# Altium project GNSS_FE_PROD.PrjPcb
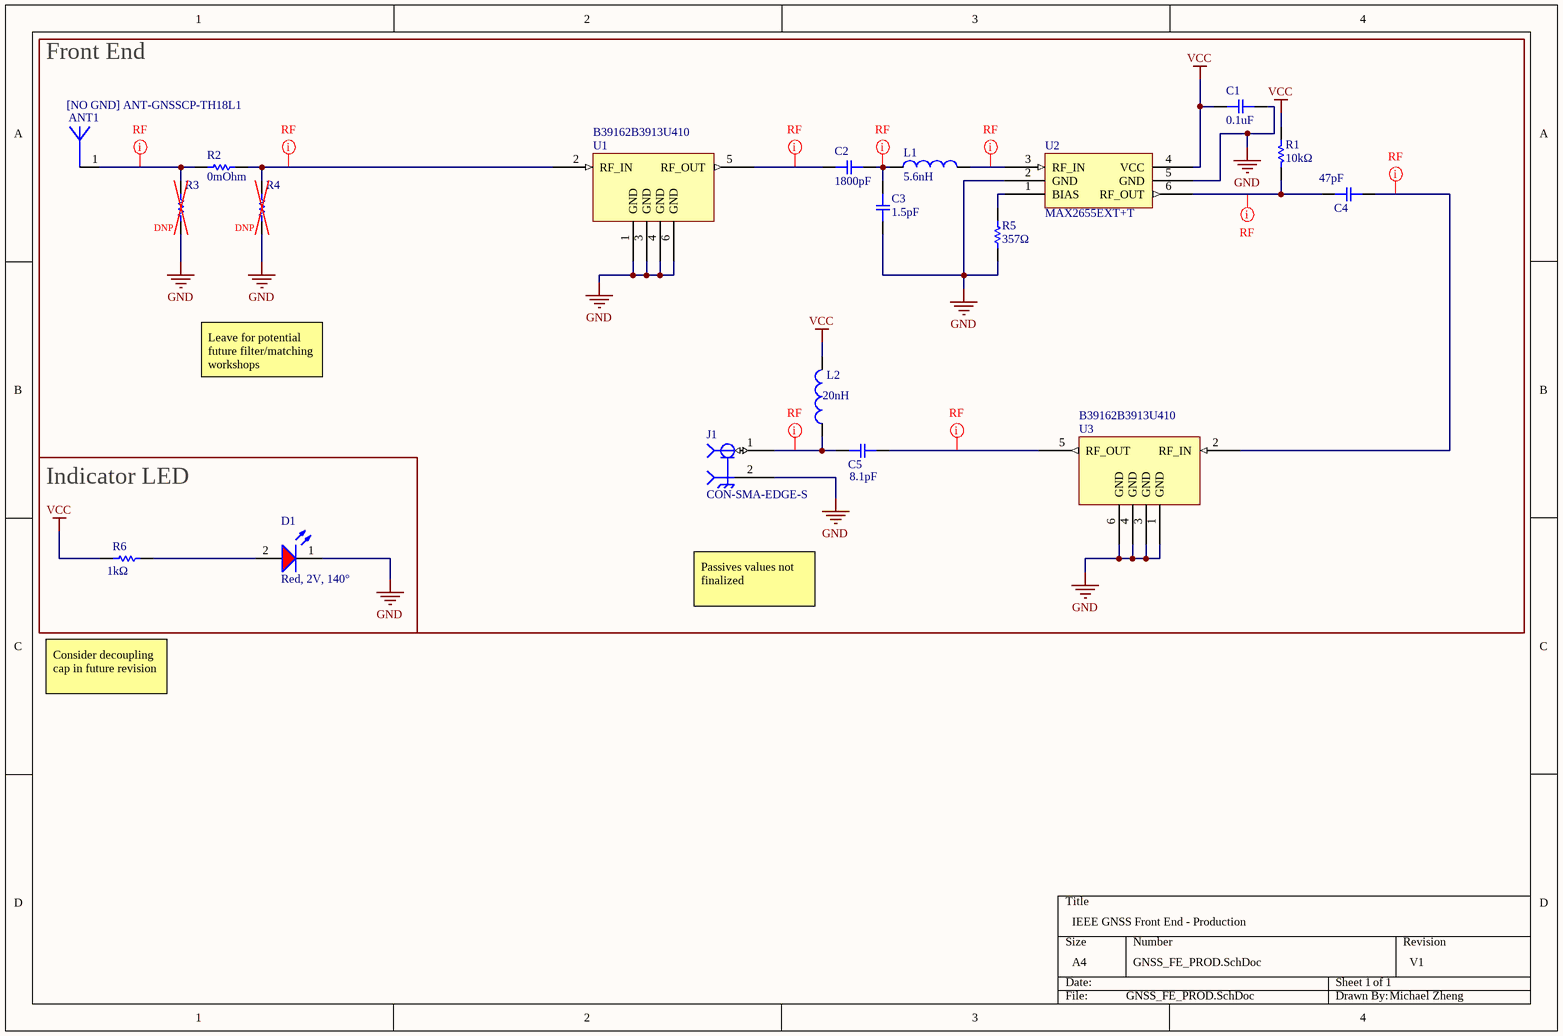
[diagram p0: GNSS_FE_PROD.SchDoc]
Author: Michael Zheng; Revision: V1; Title: IEEE GNSS Front End - Production
1 sheet, 19 parts. Net scope: global (net labels, ports and power ports of the same name join across sheets).
Board file: GNSS_FE_PROD.PcbDoc

## Sheet GNSS_FE_PROD.SchDoc: IEEE GNSS Front End - Production
size A4; SheetNumber: 1; SheetTotal: 1

### Parts
ANT1  [NO GND] ANT-GNSSCP-TH18L1  [[NO GND] ANT-GNSSCP-TH18L1]
C1  Capacitance: 0.1uF  [CAP_MURATA_0603]  (hidden comment: GCM188L81H104KA57D)
C2  Capacitance: 1800pF  [0402_CAP]  (hidden comment: GRM1555C1H182JA01D)
C3  Capacitance: 1.5pF  [0402_CAP]  (hidden comment: GJM1555C1H1R5WB01D)
C4  Capacitance: 47pF  [0402_CAP]  (hidden comment: GJM1555C1H470FB01D)
C5  Capacitance: 8.1pF  [0402_CAP]  (hidden comment: GJM1555C1H8R1BB01D)
D1  Red, 2V, 140°  [WL-SMCW]
J1  CON-SMA-EDGE-S  [RFSOLUTIONS_CON-SMA-EDGE-S]
L1  value 5.6nH  [INDC1006X60N]  (hidden comment: LQG15HN5N6C02D)
L2  value 20nH  [INDC1006X60N]  (hidden comment: LQW15AN20NG8ZD)
R1  Resistance: 10kΩ  [0402_CAP]  (hidden comment: RC0402FR-0710KL)
R2  Resistance: 0mOhm  [0402_CAP]  (hidden comment: RC0402JR-070RL)
R3  RC0402JR-070RL  [0402_CAP]  (value not drawn)
R4  RC0402JR-070RL  [0402_CAP]  (value not drawn)
R5  Resistance: 357Ω  [RC0603JR-070RL]  (hidden comment: RC0402FR-07357RL)
R6  Resistance: 1kΩ  [RC0603JR-070RL]  (hidden comment: RC0603FR-071KL)
U1  B39162B3913U410  [B39162B3913U410]
U2  MAX2655EXT+T  [MAX2655EXT+T]
U3  B39162B3913U410  [B39162B3913U410]

### Blocks framed on the sheet
Front End: ANT1 C1-C5 J1 L1 L2 R1-R5 U1-U3
Indicator LED: D1 R6

### Nets
GND: C1.2 C3.1 D1.1(K) J1.2(GND) R3.1 R4.1 R5.2 U1.1(GND) U1.3(GND) U1.4(GND) U1.6(GND) U2.2(GND) U2.5(GND) U3.1(GND) U3.3(GND) U3.4(GND) U3.6(GND)
VCC: C1.1 L2.2 R1.1 R6.1 U2.4(VCC)
NetANT1_1: ANT1.1(RF_IN) R2.2 R3.2
NetC2_1: C2.1 U1.5(RF_OUT)
NetC2_2: C2.2 C3.2 L1.2
NetC4_1: C4.1 R1.2 U2.6(RF_OUT)
NetC4_2: C4.2 U3.2(RF_IN)
NetC5_1: C5.1 U3.5(RF_OUT)
NetC5_2: C5.2 J1.1(RF) L2.1
NetD1_2: D1.2(A) R6.2
NetL1_1: L1.1 U2.3(RF_IN)
NetR2_1: R2.1 R4.2 U1.2(RF_IN)
NetR5_1: R5.1 U2.1(BIAS)

### Layout directives
net class RF: NetANT1_1, NetC2_1, NetC2_2, NetC4_1, NetC4_2, NetC5_1, NetC5_2, NetL1_1, NetR2_1

### Notes on the sheet
- (near R3) DNP
- (near R4) DNP
- Leave for potential future filter/matching workshops
- Passives values not finalized
- Consider decoupling cap in future revision

### Library data of the parts
ANT1 = [NO GND] ANT-GNSSCP-TH18L1: CERAMIC PATCH GNSS ANTENNA
C1 = GCM188L81H104KA57D: CAP CER 0.1UF 50V X8L 0603
C2 = GRM1555C1H102JA01D: CAP CER 1800PF 50V C0G/NP0 0402
C3 = GRM1555C1H102JA01D: CAP CER 1.5PF 50V C0G/NP0 0402
C4 = GRM1555C1H102JA01D: CAP CER 47PF 50V C0G/NP0 0402
C5 = GRM1555C1H102JA01D: CAP CER 8.1PF 50V C0G/NP0 0402
D1 = 150060RS75000: WL-SMCW Mono-color Chip LED Waterclear, SMT, size 0603, Red, 2V, 140°; Manufacturer: Wurth Elektronik; Case/Size Code: 0603; Chip Technology: AlInGaP; Dominant Wavelength: 625nm; Luminous Intensity: 250mcd; Peak Wavelength: 630nm; Manufacturer Part Number: 150060RS75000; Category: Signal LEDs; Match Code: WL-SMCW; ComponentLink1Description: Website Link; ComponentLink1URL: https://www.we-online.com/redexpert/article/150060RS75000?ad; ComponentLink2Description: Datasheet Link; ComponentLink2URL: https://www.we-online.com/redexpert/spec/150060RS75000?ad; Mount: Surface Mount; Operating Temperature Max: 85°C; Operating Temperature Min: -40°C; Packaging: Tape and Reel; Length: 1.6mm; Width: 0.8mm; Height: 0.7mm; Emitting Color: Red; Forward Voltage: 2V; Viewing Angle: 140°
J1 = CON-SMA-EDGE-S: CONN SMA JACK STR EDGE MNT
L1 = LQW15AN3N6C10D: FIXED IND 5.6NH 600MA 0.18OHM SM; Package: None; Price: None; MP: LQW15AN3N6C10D; Availability: Unavailable
L2 = LQW15AN3N6C10D: FIXED IND 20NH 800MA 0.186OHM SM; Package: None; Price: None; MP: LQW15AN3N6C10D; Availability: Unavailable
R1 = RC0402JR-070RL: RES 10K OHM 1% 1/16W 0402; Manufacturer: Yageo; Temperature Coefficient: 200ppm/degreesC; Tolerance: 5%; Voltage Rating: 50V; Power Rating: 100mW; Width: 0.8mm; Max Operating Temperature: 155degC; Package Reference: 0603; Height: 0.45mm; Depth: 0.8mm; Package Description: 2-Pin Surface Mount Device, Body 1.6 x 0.8 mm; Termination: SMD/SMT; Package Quantity: 5000; Case/Package: 0603; Case Code (Imperial): 0603; Radiation Hardening: No; Number of Pins: 2; Length: 1.6mm; Lead Free: LeadFree; Voltage Rating (DC): 50V; Military Standard: Not; Datasheet URL: http://www.yageo.com/NewPortal/yageodocoutput?fileName=/pdf/R-Chip/PYu-RC_Group_51_RoHS_L_5.pdf; Manufacturer URL: http://www.yageo.com/; Packaging: TapeandReel; Case Code (Metric): 1608; Min Operating Temperature: -55degC; Composition: ThickFilm; RoHSCompliant: true; Contact Plating: Tin; Datasheet Version: Rev. 5, 10/2016; REACH SVHC: NoSVHC
R2 = RC0402JR-070RL: RES 0 OHM JUMPER 1/16W 0402; Manufacturer: Yageo; Temperature Coefficient: 200ppm/degreesC; Tolerance: 5%; Voltage Rating: 50V; Power Rating: 100mW; Width: 0.8mm; Max Operating Temperature: 155degC; Package Reference: 0603; Height: 0.45mm; Depth: 0.8mm; Package Description: 2-Pin Surface Mount Device, Body 1.6 x 0.8 mm; Termination: SMD/SMT; Package Quantity: 5000; Case/Package: 0603; Case Code (Imperial): 0603; Radiation Hardening: No; Number of Pins: 2; Length: 1.6mm; Lead Free: LeadFree; Voltage Rating (DC): 50V; Military Standard: Not; Datasheet URL: http://www.yageo.com/NewPortal/yageodocoutput?fileName=/pdf/R-Chip/PYu-RC_Group_51_RoHS_L_5.pdf; Manufacturer URL: http://www.yageo.com/; Packaging: TapeandReel; Case Code (Metric): 1608; Min Operating Temperature: -55degC; Composition: ThickFilm; RoHSCompliant: true; Contact Plating: Tin; Datasheet Version: Rev. 5, 10/2016; REACH SVHC: NoSVHC
R3 R4 = RC0402JR-070RL: RES 0 OHM JUMPER 1/16W 0402; Manufacturer: Yageo; Temperature Coefficient: 200ppm/degreesC; Tolerance: 5%; Voltage Rating: 50V; Power Rating: 100mW; Resistance: 0mOhm; Width: 0.8mm; Max Operating Temperature: 155degC; Package Reference: 0603; Height: 0.45mm; Depth: 0.8mm; Package Description: 2-Pin Surface Mount Device, Body 1.6 x 0.8 mm; Termination: SMD/SMT; Package Quantity: 5000; Case/Package: 0603; Case Code (Imperial): 0603; Radiation Hardening: No; Number of Pins: 2; Length: 1.6mm; Lead Free: LeadFree; Voltage Rating (DC): 50V; Military Standard: Not; Datasheet URL: http://www.yageo.com/NewPortal/yageodocoutput?fileName=/pdf/R-Chip/PYu-RC_Group_51_RoHS_L_5.pdf; Manufacturer URL: http://www.yageo.com/; Packaging: TapeandReel; Case Code (Metric): 1608; Min Operating Temperature: -55degC; Composition: ThickFilm; RoHSCompliant: true; Contact Plating: Tin; Datasheet Version: Rev. 5, 10/2016; REACH SVHC: NoSVHC
R5 = RC0603JR-070RL: RES 357 OHM 1% 1/16W 0402; Manufacturer: Yageo; Temperature Coefficient: 200ppm/degreesC; Tolerance: 5%; Voltage Rating: 50V; Power Rating: 100mW; Width: 0.8mm; Max Operating Temperature: 155degC; Package Reference: 0603; Height: 0.45mm; Depth: 0.8mm; Package Description: 2-Pin Surface Mount Device, Body 1.6 x 0.8 mm; Termination: SMD/SMT; Package Quantity: 5000; Case/Package: 0603; Case Code (Imperial): 0603; Radiation Hardening: No; Number of Pins: 2; Length: 1.6mm; Lead Free: LeadFree; Voltage Rating (DC): 50V; Military Standard: Not; Datasheet URL: http://www.yageo.com/NewPortal/yageodocoutput?fileName=/pdf/R-Chip/PYu-RC_Group_51_RoHS_L_5.pdf; Manufacturer URL: http://www.yageo.com/; Packaging: TapeandReel; Case Code (Metric): 1608; Min Operating Temperature: -55degC; Composition: ThickFilm; RoHSCompliant: true; Contact Plating: Tin; Datasheet Version: Rev. 5, 10/2016; REACH SVHC: NoSVHC
R6 = RC0603JR-070RL: 1 kOhms ±1% 0.1W, 1/10W Chip Resistor 0603 (1608 Metric) Moisture Resistant Thick Film; Manufacturer: Yageo; Temperature Coefficient: 200ppm/degreesC; Tolerance: 5%; Voltage Rating: 50V; Power Rating: 100mW; Width: 0.8mm; Max Operating Temperature: 155degC; Package Reference: 0603; Height: 0.45mm; Depth: 0.8mm; Package Description: 2-Pin Surface Mount Device, Body 1.6 x 0.8 mm; Termination: SMD/SMT; Package Quantity: 5000; Case/Package: 0603; Case Code (Imperial): 0603; Radiation Hardening: No; Number of Pins: 2; Length: 1.6mm; Lead Free: LeadFree; Voltage Rating (DC): 50V; Military Standard: Not; Datasheet URL: http://www.yageo.com/NewPortal/yageodocoutput?fileName=/pdf/R-Chip/PYu-RC_Group_51_RoHS_L_5.pdf; Manufacturer URL: http://www.yageo.com/; Packaging: TapeandReel; Case Code (Metric): 1608; Min Operating Temperature: -55degC; Composition: ThickFilm; RoHSCompliant: true; Contact Plating: Tin; Datasheet Version: Rev. 5, 10/2016; REACH SVHC: NoSVHC
U1 U3 = B39162B3913U410: FILTER SAW 1.588GHZ 6SMD
U2 = MAX2655EXT+T: IC AMP GPS 1.4GHZ-1.7GHZ SC70-6

## Assembly variants
Variant of GNSS_FE_PROD: not fitted R3 R4